# EAGLE design beranek (EAGLE 9.5.1)
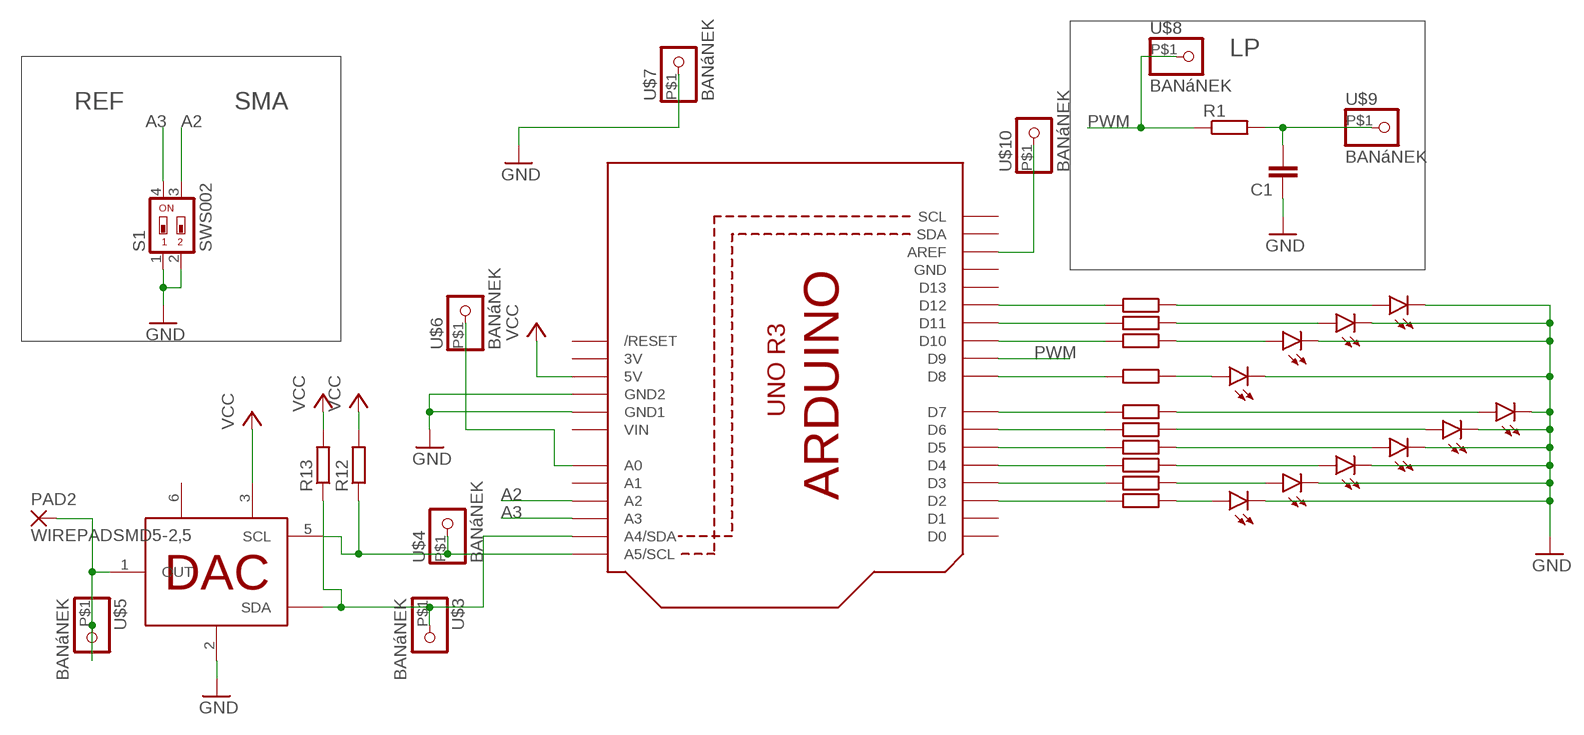
[diagram p0: schematic, sheet 1]

## Parts
C1  C-EUC0805  [C0805]
LD2  PL006-WCR12  [SOT23]
LD3  PL006-WCR12  [SOT23]
LD4  PL006-WCR12  [SOT23]
LD5  PL006-WCR12  [SOT23]
LD6  PL006-WCR12  [SOT23]
LD7  PL006-WCR12  [SOT23]
LD8  PL006-WCR12  [SOT23]
LD9  PL006-WCR12  [SOT23]
LD10  PL006-WCR12  [SOT23]
LD11  PL006-WCR12  [SOT23]
PAD2  WIREPADSMD5-2,5  [5-2,5]
Q1  ARDUINOR3-NOIOREF-NOTEXT  [ARDUINOR3-NOTEXT-NOIOREF]
R1  R-EU_R1206  [R1206]
R2  R-EU_R1206  [R1206]
R3  R-EU_R1206  [R1206]
R4  R-EU_R1206  [R1206]
R5  R-EU_R1206  [R1206]
R6  R-EU_R1206  [R1206]
R7  R-EU_R1206  [R1206]
R8  R-EU_R1206  [R1206]
R9  R-EU_R1206  [R1206]
R10  R-EU_R1206  [R1206]
R11  R-EU_R1206  [R1206]
R12  R-EU_R0805  [R0805]
R13  R-EU_R0805  [R0805]
S1  SWS002  [SMS-002]
U$1  MCP4726  [TSOT23-6]
U$3  BANáNEK  [BANANEK]
U$4  BANáNEK  [BANANEK]
U$5  BANáNEK  [BANANEK]
U$6  BANáNEK  [BANANEK]
U$7  BANáNEK  [BANANEK]
U$8  BANáNEK  [BANANEK]
U$9  BANáNEK  [BANANEK]
U$10  BANáNEK  [BANANEK]

## Nets
A2: Q1.A2 S1.3
A3: Q1.A3 S1.4
GND: C1.1 LD2.3(C) LD3.3(C) LD4.3(C) LD5.3(C) LD6.3(C) LD7.3(C) LD8.3(C) LD9.3(C) LD10.3(C) LD11.3(C) Q1.GND1 Q1.GND2 S1.1 S1.2 U$1.2(VSS) U$7.P$1
N$1: PAD2.1(P) U$1.1(OUT) U$5.P$1
N$2: Q1.A4(A4/SDA) R13.1 U$1.4(SDA) U$3.P$1
N$4: Q1.A0 U$6.P$1
N$5: C1.2 R1.2 U$9.P$1
N$6: Q1.D2 R2.2
N$7: Q1.D3 R3.2
N$8: Q1.D4 R4.2
N$9: Q1.D5 R5.2
N$10: Q1.D6 R6.2
N$11: Q1.D7 R7.2
N$12: Q1.D8 R8.2
N$13: LD2.1(A) R2.1
N$14: LD3.1(A) R3.1
N$15: LD4.1(A) R4.1
N$16: LD7.1(A) R7.1
N$17: LD6.1(A) R6.1
N$18: LD5.1(A) R5.1
N$19: LD8.1(A) R8.1
N$20: Q1.D10 R9.2
N$21: LD9.1(A) R9.1
N$22: Q1.D11 R10.2
N$23: LD10.1(A) R10.1
N$24: Q1.D12 R11.2
N$25: LD11.1(A) R11.1
N$27: Q1.AREF U$10.P$1
PWM: Q1.D9 R1.1 U$8.P$1
SCL: Q1.A5(A5/SCL) R12.1 U$1.5(SCL) U$4.P$1
VCC: Q1.5V R12.2 R13.2 U$1.3(VDD)
Unconnected: Q1.A1 Q1.D0 Q1.D1 Q1.D13 Q1.RESET(/RESET) Q1.SCL Q1.SDA U$1.6(VREF)

## Notes on the sheet
- LP
- REF | SMA

## Power pins joined to a net without a drawn wire
3V: Q1.3V
GND: Q1.GND
VIN: Q1.VIN

## Library data of the parts
C1 = rcl:C-EU: CAPACITOR, European symbol; SPICEPREFIX: C
LD2-LD11 = led:PL006*: PLH006 Series SMD LED SOT23 PLH006-WCR21 Super Red PLH006-WCR12 High Eff Red PLH006-WCG13 Green PLH006-WCY01 Yellow www.p-tec.net Source: http://www.wittig-electronic.de/PTEC/PL006Series.pdf
PAD2 = wirepad:WIREPAD: Wire PAD connect wire on PCB
Q1 = adafruit:ARDUINOR3-NOIOREF
R1-R11 = rcl_my:R-EU_: RESISTOR, European symbol
R12 R13 = rcl:R-EU_: RESISTOR, European symbol; SPICEPREFIX: R
S1 = smd-special:SWS002: SMD Dip Switch 2 pol.
U$1 = DAC:MCP4726
U$3-U$10 = bananek:BANáNEK

## Board
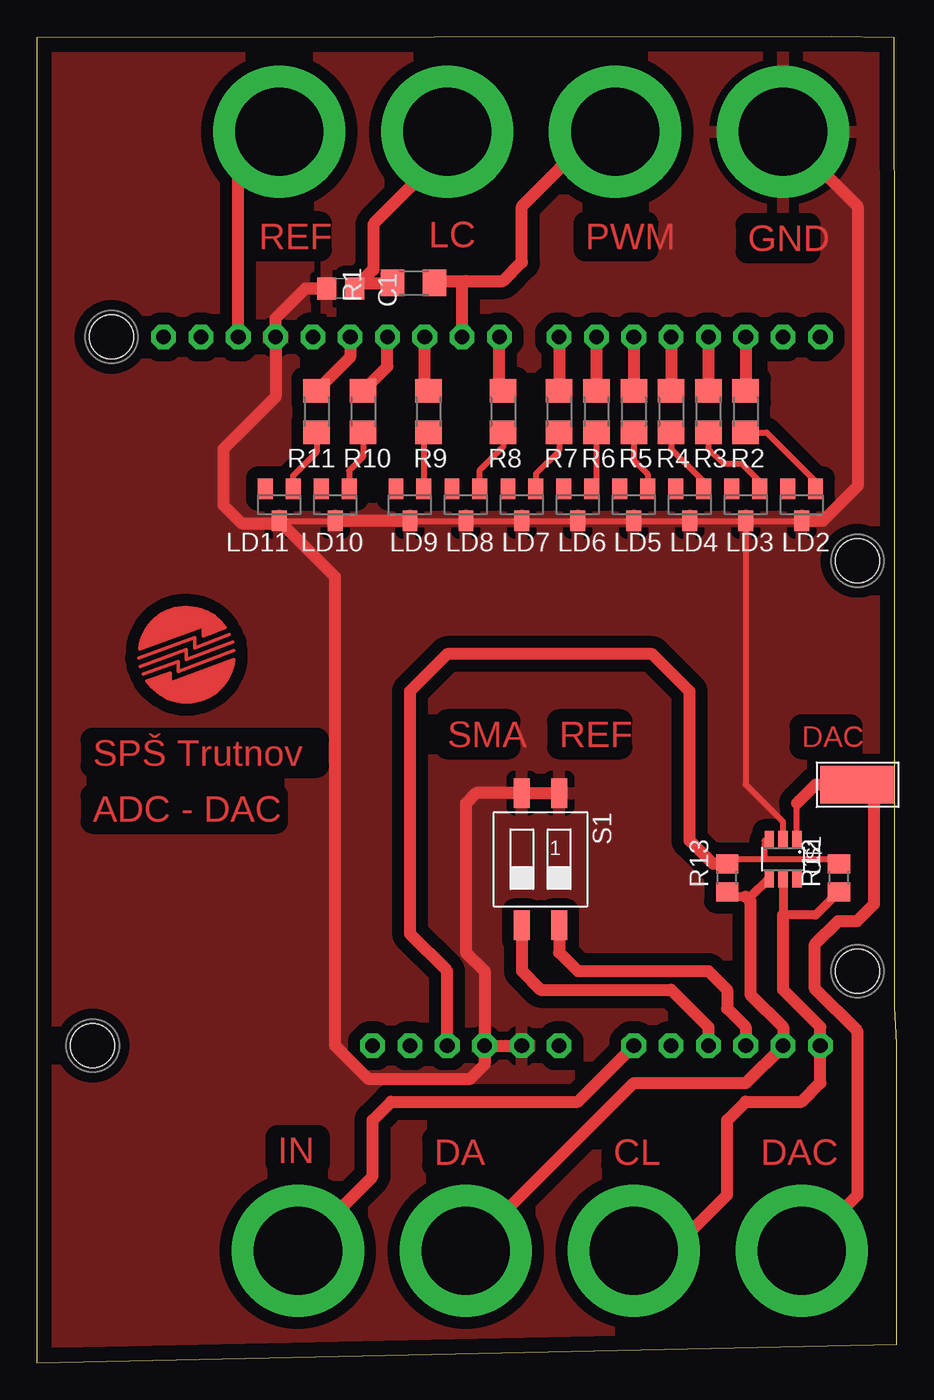
[diagram p1: board, top side]
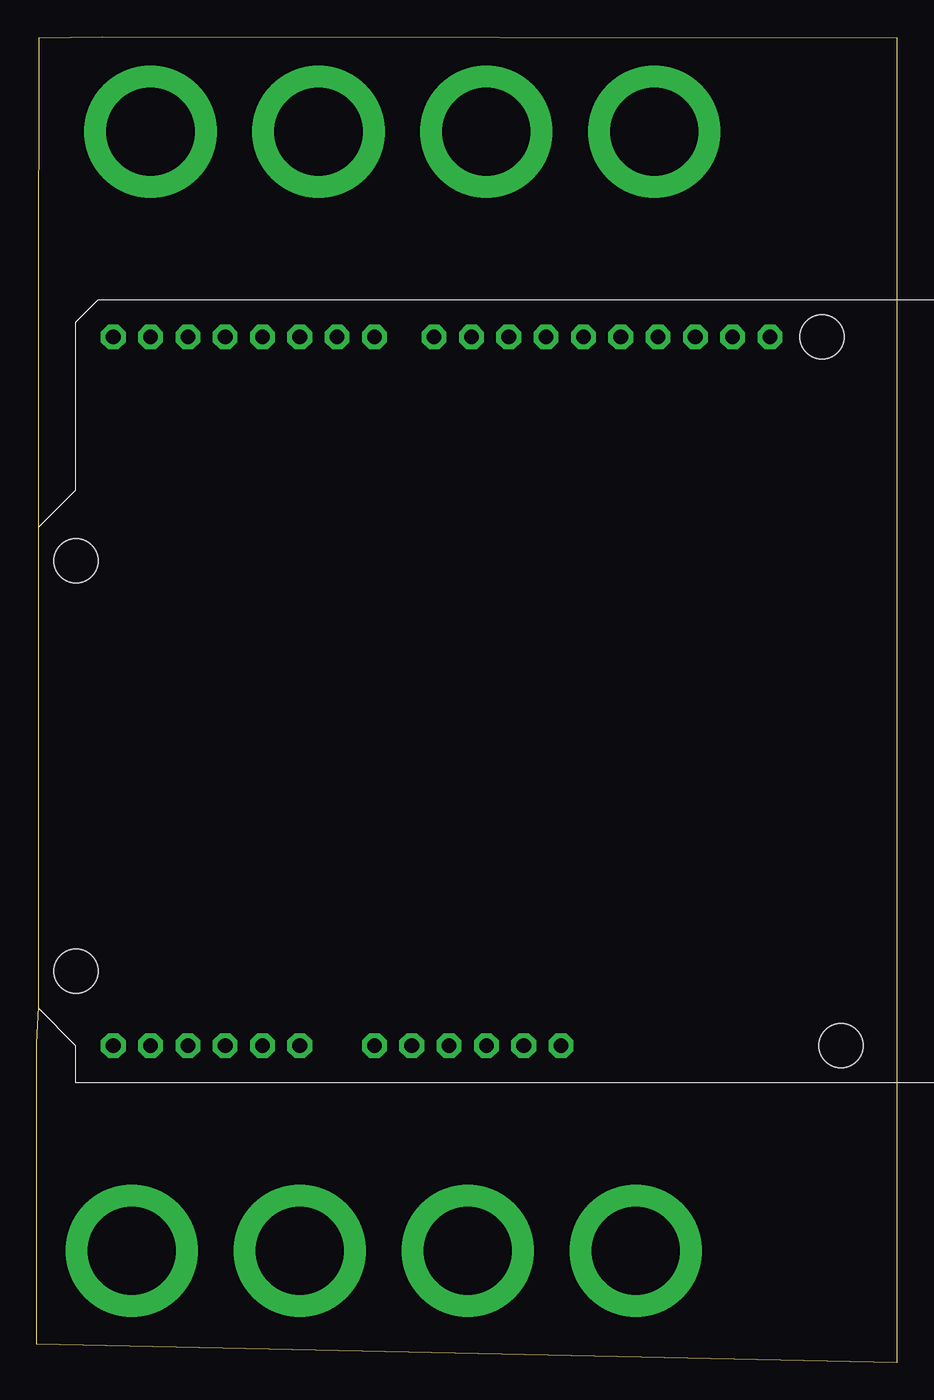
[diagram p2: board, bottom side, seen from below]

Size 58.55 x 90.3 mm. Coordinates in mm from the lower left corner, seen from the top.
Outline: 0,0 58.55,1.27 58.55,21.72 58.4,24.26 58.42,55.88 58.4,56.92 58.4,72.19 58.37,90.22 54.1,90.3 0,90.22 0,0
Copper layers (1*16): Top 0.035mm / dielectric 1.5mm / Bottom 0.035mm
Design rules "SPS_Trutnov_F14": minimum track width 0.3mm, minimum drill 0.6mm, track to track 8mil, track to pad 0.2mm, pad to pad 0.2mm, via to via 0.2mm, smd to smd 0mil, copper to edge 1mm, drill to drill 0.6mm, minimum pad ring 0.3mm, minimum via ring 0.3mm, stop-mask expansion 0.1mm, vias tented up to drill 3mm, thermal gap 20mil
Holes 3 mm at 3.81,21.59 55.88,26.67 55.88,54.61 5.08,69.85

### Footprints (pad centres in the part's own frame; a part is rotated, then mirrored left to right if it is on the bottom)
C0805 = smd 1.3 x 1.5: 1 -0.95,0; 2 0.95,0
SOT23 = smd 1 x 1.4: 1 -0.95,-1.1; 2 0.95,-1.1; 3 0,1.1
5-2,5 = smd 2.54 x 5.08: 1 0,0
ARDUINOR3-NOTEXT-NOIOREF = drill 1 pad 1.676 octagon: 3V 35.56,2.54; 5V 38.1,2.54; A0 50.8,2.54; A1 53.34,2.54; A2 55.88,2.54; A3 58.42,2.54; A4 60.96,2.54; A5 63.5,2.54; AREF 23.876,50.8; D0 63.5,50.8; D1 60.96,50.8; D2 58.42,50.8; D3 55.88,50.8; D4 53.34,50.8; D5 50.8,50.8; D6 48.26,50.8; D7 45.72,50.8; D8 41.656,50.8; D9 39.116,50.8; D10 36.576,50.8; D11 34.036,50.8; D12 31.496,50.8; D13 28.956,50.8; GND 26.416,50.8; GND1 43.18,2.54; GND2 40.64,2.54; RESET 33.02,2.54; SCL 18.796,50.8; SDA 21.336,50.8; VIN 45.72,2.54
R1206 = smd 1.6 x 1.803: 1 -1.422,0; 2 1.422,0
R0805 = smd 1.3 x 1.5: 1 -0.95,0; 2 0.95,0
SMS-002 = smd 1.092 x 2.007: 1 -1.27,-4.496; 2 1.27,-4.496; 3 1.27,4.496; 4 -1.27,4.496
TSOT23-6 = smd 0.62 x 1.22: 1 -0.95,-1.3; 2 0,-1.3; 3 0.95,-1.3; 4 0.95,1.3; 5 0,1.3; 6 -0.95,1.3
BANANEK = drill 6 pad 9: P$1 0,0

### Placement (x,y rotation side)
C1  20.7,73.15 0 top
LD2  52.07,58.42 180 top
LD3  48.26,58.42 180 top
LD4  44.45,58.42 180 top
LD5  40.64,58.42 180 top
LD6  36.83,58.42 180 top
LD7  33.02,58.42 180 top
LD8  29.21,58.42 180 top
LD9  25.4,58.42 180 top
LD10  20.32,58.42 180 top
LD11  16.51,58.42 180 top
PAD2  55.88,39.37 90 top
Q1  -10.16,19.05 0 top
R1  25.65,73.53 180 top
R2  48.26,64.77 90 top
R3  45.72,64.77 90 top
R4  43.18,64.77 90 top
R5  40.64,64.77 90 top
R6  38.1,64.77 90 top
R7  35.56,64.77 90 top
R8  31.75,64.77 90 top
R9  26.67,64.77 90 top
R10  22.22,64.77 90 top
R11  19.05,64.77 90 top
R12  54.61,33.02 90 top
R13  46.99,33.02 90 top
S1  34.29,34.29 180 top
U$1  50.8,34.29 180 top
U$2  [LOGO_SPS_TRUTNOV]  10.16,48.26 0 top
U$3  29.21,7.62 0 top
U$4  40.64,7.62 0 top
U$5  52.07,7.62 0 top
U$6  17.78,7.62 0 top
U$7  50.8,83.82 0 top
U$8  39.37,83.82 0 top
U$9  27.94,83.82 0 top
U$10  16.51,83.82 0 top

### Tracks (layer width: path | path; a pad name or v marks a point on that pad's centre or on a via)
A2
  Top 0.813: Q1.A2 45.72,22.86 43.18,25.4 34.29,25.4 33.02,26.67 S1.3
A3
  Top 0.813: Q1.A3 48.26,22.86 46.99,24.13 46.99,25.4 45.72,26.67 36.83,26.67 35.56,27.94 S1.4
GND
  Top 0.406: LD11.3 LD10.3 | LD9.3 LD8.3 LD7.3 LD6.3 LD5.3 LD4.3 LD3.3 | LD3.3 LD2.3 | LD3.3 48.26,39.37 50.8,36.83 U$1.2
  Top 0.813: S1.1 S1.2 29.9,38.79 29.21,38.1 29.21,27.94 30.48,26.67 Q1.GND2 | Q1.GND2 Q1.GND1 | Q1.GND2 30.48,20.32 29.46,19.3 22.61,19.3 20.32,21.59 20.32,53.51 LD11.3 16.34,57.15 13.97,57.15 12.7,58.42 12.7,62.23 16.26,65.79 Q1.GND 16.26,71.12 18.29,73.15 C1.1 | U$7.P$1 55.88,78.74 55.88,59.69 53.51,57.32 LD2.3 | LD9.3 LD10.3
  pour Top (isolate 0.813): 0,1.27 58.42,1.27 58.42,90.17 0,90.17
N$1
  Top 0.406: U$1.1 51.75,38.1 51.75,38.42
  Top 0.813: U$5.P$1 55.88,11.43 55.88,22.56 52.97,25.47 52.97,28.51 54.55,30.08 55.84,30.08 57,31.24 57,39.37 PAD2.1 53.02,39.37 51.75,38.1
N$2
  Top 0.61: R13.1 47.31,31.75 48.26,31.75 48.61,31.75 U$1.4
  Top 0.813: 48.26,31.75 48.58,31.43 48.58,25.08 50.8,22.86 Q1.A4 48.26,19.05 40.64,19.05 U$3.P$1
N$4
  Top 0.813: 40.39,21.59 Q1.A0 36.83,17.78 24.13,17.78 22.86,16.51 22.86,12.7 U$6.P$1
N$5
  Top 0.813: R1.2 22.03,73.53 C1.2 22.92,74.42 22.92,77.53 27.94,82.55 U$9.P$1
N$6
  Top 0.813: Q1.D2 R2.2
N$7
  Top 0.813: Q1.D3 R3.2
N$8
  Top 0.813: Q1.D4 R4.2
N$9
  Top 0.813: Q1.D5 R5.2
N$10
  Top 0.813: Q1.D6 R6.2
N$11
  Top 0.813: Q1.D7 R7.2
N$12
  Top 0.813: R8.2 31.5,66.45 Q1.D8
N$13
  Top 0.406: R2.1 49.68,63.35 53.27,59.77 LD2.1
N$14
  Top 0.406: R3.1 45.72,62.23 46.74,61.21 48.01,61.21 49.21,60.01 LD3.1
N$15
  Top 0.406: R4.1 43.18,62.23 45.4,60.01 LD4.1
N$16
  Top 0.406: R7.1 35.56,62.13 33.97,60.54 LD7.1
N$17
  Top 0.406: R6.1 38.1,59.84 LD6.1
N$18
  Top 0.406: LD5.1 41.59,60.52 40.64,61.47 R5.1
N$19
  Top 0.406: R8.1 31.75,62.38 30.16,60.79 LD8.1
N$20
  Top 0.813: R9.2 26.42,66.45 Q1.D10
N$21
  Top 0.406: R9.1 26.35,63.03 LD9.1
N$22
  Top 0.813: R10.2 23.88,67.84 Q1.D11
N$23
  Top 0.406: R10.1 22.22,61.7 21.27,60.74 LD10.1
N$24
  Top 0.813: Q1.D12 21.34,68.48 R11.2
N$25
  Top 0.406: R11.1 19.05,62 17.46,60.41 LD11.1
N$27
  Top 0.813: Q1.AREF 13.72,81.03 U$10.P$1
PWM
  Top 0.813: R1.1 27.2,73.66 29.21,73.66 | 29.21,73.66 31.75,73.66 33.02,74.93 33.02,78.74 38.1,83.82 U$8.P$1 | Q1.D9 28.96,73.41 29.21,73.66
SCL
  Top 0.61: U$1.5 50.8,30.48 53.02,30.48 R12.1
  Top 0.813: 50.8,30.48 50.8,25.4 53.34,22.86 Q1.A5 53.34,19.05 52.07,17.78 48.26,17.78 46.99,16.51 46.99,11.43 43.18,7.62 U$4.P$1
VCC
  Top 0.406: 49.53,35.56 49.82,35.56 U$1.3 49.53,35.27 49.53,34.29 | R12.2 54.29,34.29 49.53,34.29 | 49.53,34.29 46.99,34.29 R13.2
  Top 0.813: Q1.5V 27.94,26.67 25.4,29.21 25.4,45.72 27.94,48.26 41.91,48.26 44.45,45.72 44.45,35.56 46.04,33.97 R13.2

### Text on the board
Top: REF | LC | PWM | GND | SMA | REF | DAC | SPŠ Trutnov | ADC - DAC | IN | DA | CL | DAC